# EAGLE design Yahtzee (EAGLE 9.6.2)
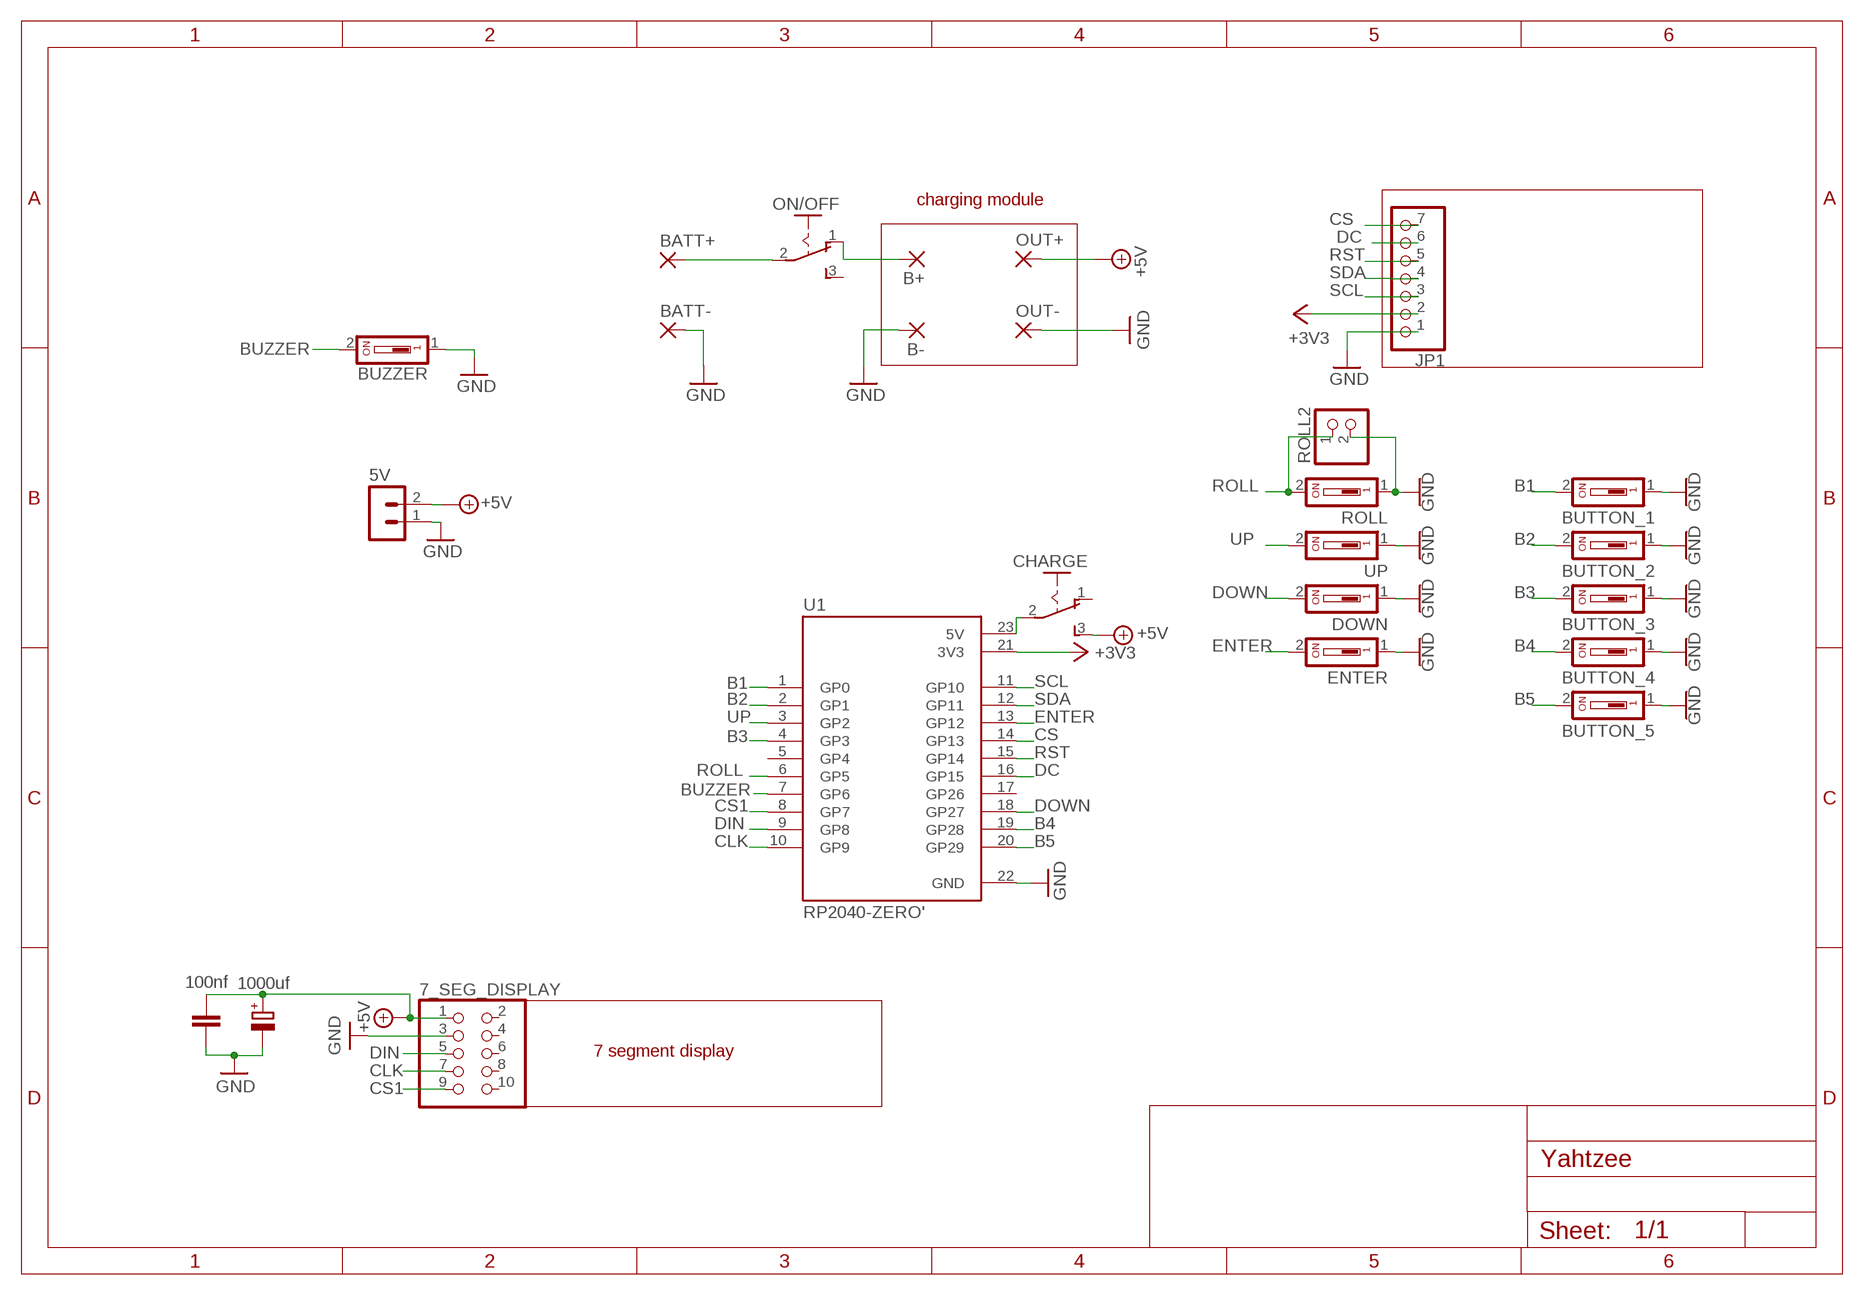
[diagram p0: schematic, sheet 1]

## Parts
5V  B2B-PH-K-S  [B2B-PH-K-S]
7_SEG_DISPLAY  PINHD-2X5  [2X05]
B+  SMD5  [SMD2,54-5,08]
B-  SMD5  [SMD2,54-5,08]
BATT+  SMD5  [SMD2,54-5,08]
BATT-  SMD5  [SMD2,54-5,08]
BUTTON_1  DS01  [DS-01]
BUTTON_2  DS01  [DS-01]
BUTTON_3  DS01  [DS-01]
BUTTON_4  DS01  [DS-01]
BUTTON_5  DS01  [DS-01]
BUZZER  DS01  [DS-01]
C1  100nf  C-EU050-024X044  [C050-024X044]
C2  1000uf  CPOL-EUE2.5-7  [E2,5-7]
CHARGE  M251  [M251]
DOWN  DS01  [DS-01]
ENTER  DS01  [DS-01]
JP1  PINHD-1X7  [1X07]
ON/OFF  M251  [M251]
OUT+  SMD5  [SMD2,54-5,08]
OUT-  SMD5  [SMD2,54-5,08]
ROLL  DS01  [DS-01]
ROLL2  PINHD-1X2  [1X02]
U1  RP2040-ZERO'  [MODULE_RP2040-ZERO]
UP  DS01  [DS-01]

## Nets
+3V3: JP1.2 U1.21(3V3)
+5V: 5V.2 7_SEG_DISPLAY.1 C1.1 C2.+ CHARGE.3(S) OUT+.1(P)
B1: BUTTON_1.2 U1.1(GP0)
B2: BUTTON_2.2 U1.2(GP1)
B3: BUTTON_3.2 U1.4(GP3)
B4: BUTTON_4.2 U1.19(GP28)
B5: BUTTON_5.2 U1.20(GP29)
BUZZER: BUZZER.2 U1.7(GP6)
CLK: 7_SEG_DISPLAY.7 U1.10(GP9)
CS: JP1.7 U1.14(GP13)
CS1: 7_SEG_DISPLAY.9 U1.8(GP7)
DC: JP1.6 U1.16(GP15)
DIN: 7_SEG_DISPLAY.5 U1.9(GP8)
DOWN: DOWN.2 U1.18(GP27)
ENTER: ENTER.2 U1.13(GP12)
GND: 5V.1 7_SEG_DISPLAY.3 B-.1(P) BATT-.1(P) BUTTON_1.1 BUTTON_2.1 BUTTON_3.1 BUTTON_4.1 BUTTON_5.1 BUZZER.1 C1.2 C2.- DOWN.1 ENTER.1 JP1.1 OUT-.1(P) ROLL2.2 ROLL.1 U1.22(GND) UP.1
N$1: BATT+.1(P) ON/OFF.2(P)
N$2: B+.1(P) ON/OFF.1(O)
N$3: CHARGE.2(P) U1.23(5V)
ROLL: ROLL2.1 ROLL.2 U1.6(GP5)
RST: JP1.5 U1.15(GP14)
SCL: JP1.3 U1.11(GP10)
SDA: JP1.4 U1.12(GP11)
UP: U1.3(GP2) UP.2
Unconnected: 7_SEG_DISPLAY.2 7_SEG_DISPLAY.4 7_SEG_DISPLAY.6 7_SEG_DISPLAY.8 7_SEG_DISPLAY.10 CHARGE.1(O) ON/OFF.3(S) U1.5(GP4) U1.17(GP26)

## Notes on the sheet
- charging module
- 7 segment display

## Library data of the parts
5V = con-JST PH:B2B-PH: JST PH series header 2.00mm pitch disconnectable crimp style connectors, vertical (side entry type), 2 pins
7_SEG_DISPLAY = pinhead:PINHD-2X5: PIN HEADER
B+ B- BATT+ BATT- OUT+ OUT- = wirepad:SMD5: SMD PAD
BUTTON_1-BUTTON_5 DOWN ENTER ROLL UP = 5mm SPST Switch:DS01: DIL/CODE SWITCH; OC_FARNELL: unknown; OC_NEWARK: unknown
BUZZER = buzzer:DS01: DIL/CODE SWITCH; OC_FARNELL: unknown; OC_NEWARK: unknown
C1 = rcl:C-EU: CAPACITOR, European symbol; SPICEPREFIX: C
C2 = rcl:CPOL-EU: POLARIZED CAPACITOR, European symbol; SPICEPREFIX: C
CHARGE ON/OFF = switches M Dunn:M251: SLIDING SWITCH Mors, distributor Buerklin, 11G702
JP1 = pinhead:PINHD-1X7: PIN HEADER
ROLL2 = pinhead:PINHD-1X2: PIN HEADER
U1 = RP2040-ZERO:RP2040-ZERO: Check availability <https://pricing.snapeda.com/parts/RP2040-ZERO/Waveshare%20Electronics/view-part?ref=eda>; AVAILABILITY: Not in stock; CHECK_PRICES: https://www.snapeda.com/parts/RP2040-ZERO/Waveshare+Electronics/view-part/?ref=eda; DESCRIPTION: Low-Cost, High-Performance Pico-Like MCU Board Based On Raspberry Pi Microcontroller RP2040; MF: Waveshare Electronics; MP: RP2040-ZERO; PACKAGE: Package; PRICE: None; SNAPEDA_LINK: https://www.snapeda.com/parts/RP2040-ZERO/Waveshare+Electronics/view-part/?ref=snap

## Board
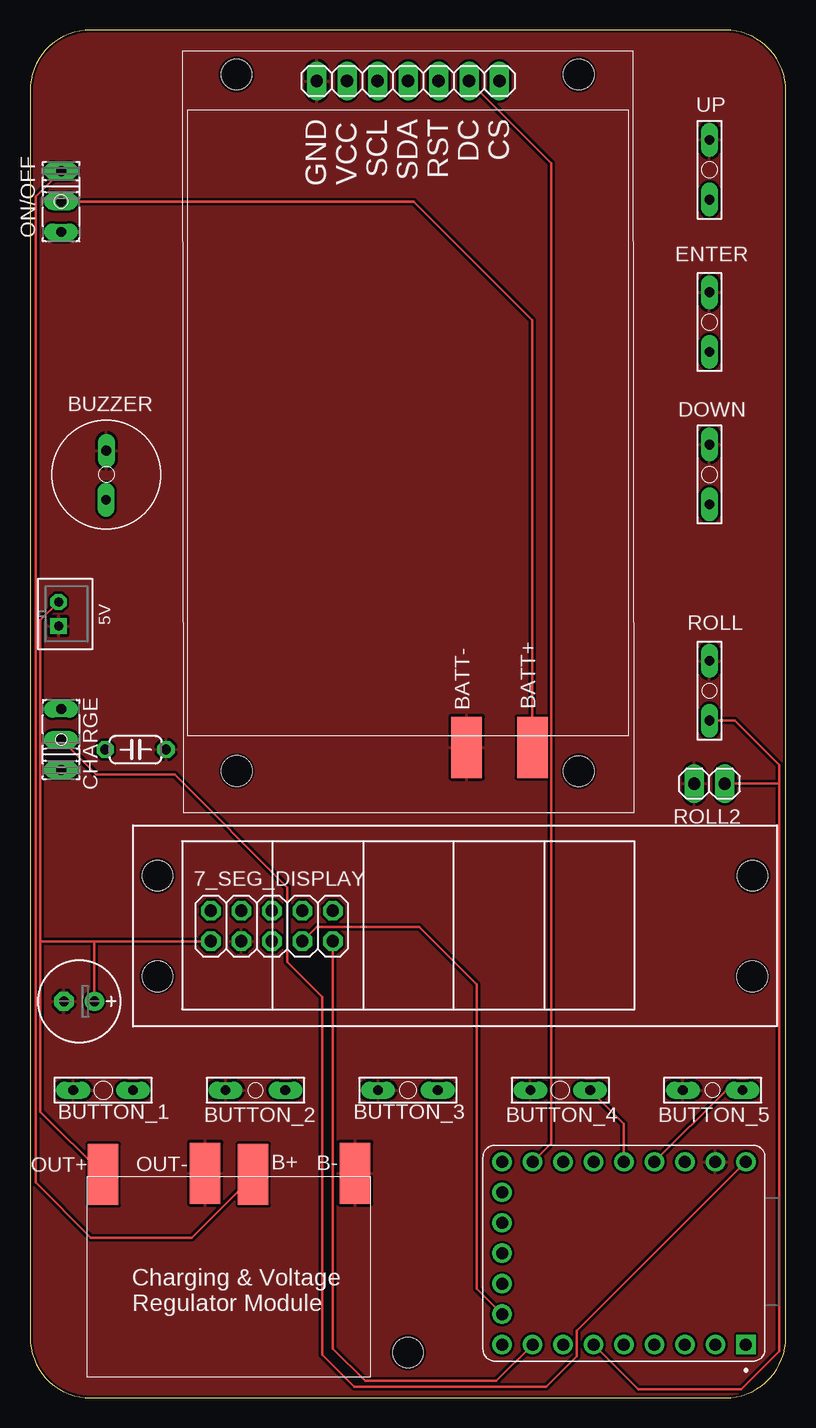
[diagram p1: board, top side]
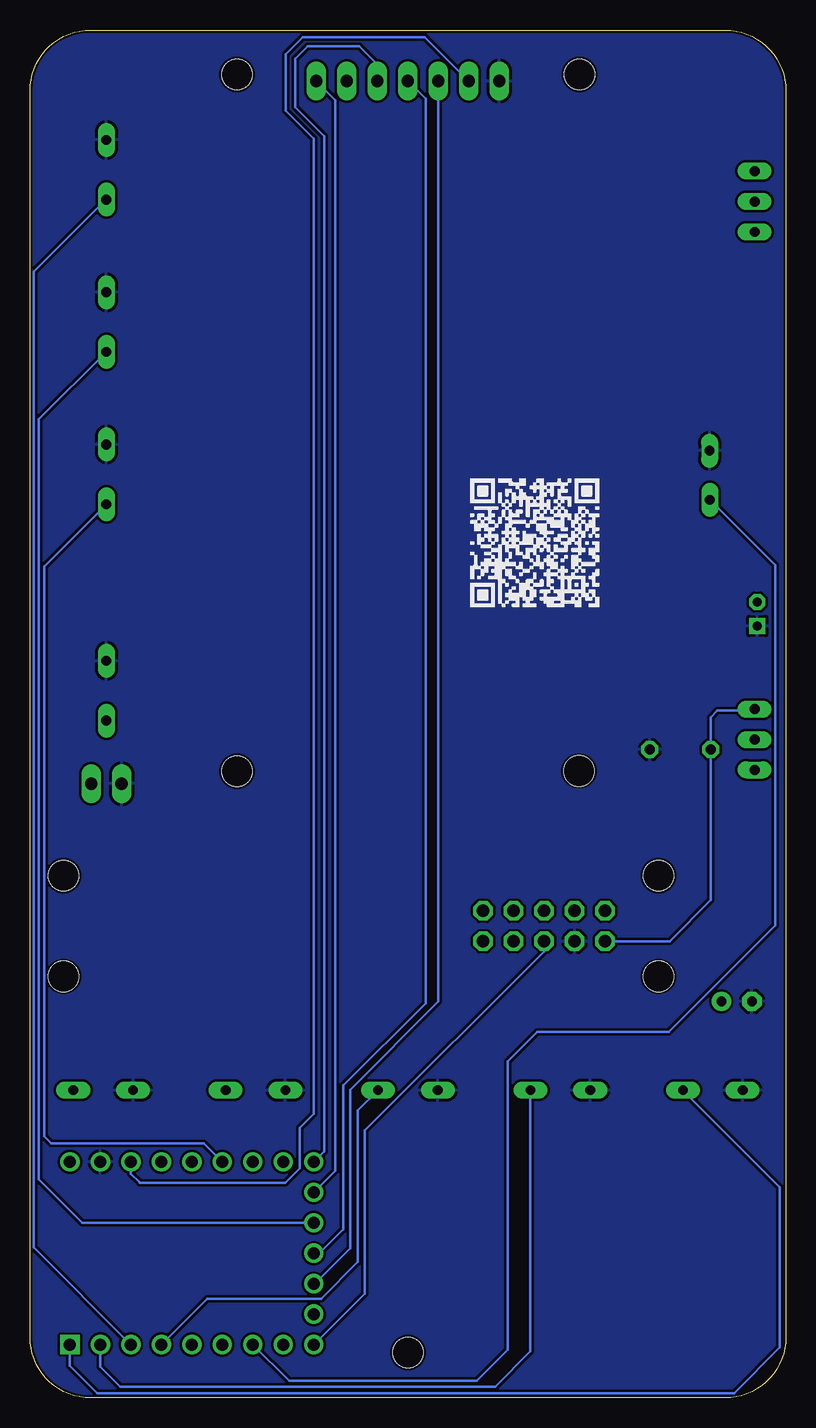
[diagram p2: board, bottom side, seen from below]

Size 62.99 x 114.04 mm. Coordinates in mm from the lower left corner, seen from the top.
Outline: 57.91,114.04 5.08,114.04 arc90 0,108.96 0,5.08 arc90 5.08,0 57.91,0 arc90 62.99,5.08 62.99,108.96 arc90 57.91,114.04
Copper layers (1*16): Top 0.035mm / dielectric 1.5mm / Bottom 0.035mm
Design rules "SparkFun": minimum track width 8mil, minimum drill 20mil, track to track 8mil, track to pad 8mil, pad to pad 8mil, via to via 8mil, smd to smd 8mil, copper to edge 8mil, drill to drill 8mil, minimum pad ring 12mil, minimum via ring 10mil, stop-mask expansion 4mil, vias tented up to drill 20mil, thermal gap 10mil
Holes 2.54 mm at 45.73,110.34 45.73,52.24 17.23,52.26 17.2,110.34 10.62,43.55 10.61,35.14 60.21,43.55 60.19,35.14 31.49,3.8

### Footprints (pad centres in the part's own frame; a part is rotated, then mirrored left to right if it is on the bottom)
B2B-PH-K-S = drill 0.75 pad 1.3 square: 1 1,0 | drill 0.75 pad 1.3 octagon: 2 -1,0
2X05 = drill 1.016 octagon: 1 -5.08,-1.27; 2 -5.08,1.27; 3 -2.54,-1.27; 4 -2.54,1.27; 5 0,-1.27; 6 0,1.27; 7 2.54,-1.27; 8 2.54,1.27; 9 5.08,-1.27; 10 5.08,1.27
SMD2,54-5,08 = smd 2.54 x 5.08: 1 0,0
DS-01 = drill 0.813 long: 1 2.489,0; 2 -2.489,0
DS-01' = drill 0.813 long: 1 0,-1.981; 2 0.025,2.108
C050-024X044 = drill 0.813 octagon: 1 -2.54,0; 2 2.54,0
E2,5-7 = drill 0.813 pad 1.6: + -1.27,0 | drill 0.813 pad 1.6 octagon: - 1.27,0
M251 = drill 0.813 long: 1 -2.54,0; 2 0,0; 3 2.54,0
1X07 = drill 1.016 long: 1 -7.62,0; 2 -5.08,0; 3 -2.54,0; 4 0,0; 5 2.54,0; 6 5.08,0; 7 7.62,0
1X02 = drill 1.016 long: 1 -1.27,0; 2 1.27,0
MODULE_RP2040-ZERO = drill 1 square: 1 7.62,10.16 | drill 1: 2 7.62,7.62; 3 7.62,5.08; 4 7.62,2.54; 5 7.62,0; 6 7.62,-2.54; 7 7.62,-5.08; 8 7.62,-7.62; 9 7.62,-10.16; 10 5.08,-10.16; 11 2.54,-10.16; 12 0,-10.16; 13 -2.54,-10.16; 14 -5.08,-10.16; 15 -7.62,-10.16; 16 -7.62,-7.62; 17 -7.62,-5.08; 18 -7.62,-2.54; 19 -7.62,0; 20 -7.62,2.54; 21 -7.62,5.08; 22 -7.62,7.62; 23 -7.62,10.16

### Placement (x,y rotation side)
5V  2.38,65.35 270 top
7_SEG_DISPLAY  20.15,39.34 0 top
B+  18.59,18.63 180 top
B-  27.1,18.73 180 top
BATT+  41.87,54.23 0 top
BATT-  36.38,54.23 0 top
BUTTON_1  6.09,25.65 180 top
BUTTON_2  18.79,25.65 180 top
BUTTON_3  31.49,25.65 180 top
BUTTON_4  44.19,25.65 180 top
BUTTON_5  56.89,25.65 180 top
BUZZER  [DS-01']  6.36,76.99 180 top
C1  8.8,54.05 0 top
C2  4.1,33.06 180 top
CHARGE  2.6,54.89 90 top
DOWN  56.62,76.99 90 top
ENTER  56.62,89.69 90 top
JP1  31.5,109.78 0 top
ON/OFF  2.6,99.73 270 top
OUT+  6.09,18.63 0 top
OUT-  14.6,18.73 180 top
ROLL  56.62,58.95 90 top
ROLL2  56.62,51.21 180 top
U1  49.5,12.07 270 top
UP  56.62,102.39 90 top

### Tracks (layer width: path | path; a pad name or v marks a point on that pad's centre or on a via)
+3V3
  Bottom 0.203: JP1.2 30.08,113.44 40.24,113.44 41.66,112.01 41.66,107.3 39.36,104.99 39.36,23.67 40.5,22.53 40.5,19.15 41.71,17.93 53.83,17.93 53.89,18 54.59,18.69 54.59,19.67 U1.21
+5V
  Top 0.203: OUT+.1 0.87,23.85 0.87,38.07 | 5V.2 0.87,64.84 0.87,38.07 | 0.87,38.07 5.37,38.07 | 5.37,38.07 7_SEG_DISPLAY.1 | C2.+ 5.37,38.07
  Bottom 0.203: 7_SEG_DISPLAY.1 9.69,38.07 6.26,41.5 C1.1 6.26,56.74 5.7,57.3 2.73,57.3 CHARGE.3
B1
  Bottom 0.203: BUTTON_1.2 0.49,17.56 0.49,4.22 4.3,0.41 57.4,0.41 59.66,2.67 U1.1
B2
  Bottom 0.203: BUTTON_2.2 21.28,3.87 24.21,0.94 55.48,0.94 57.12,2.58 U1.2
B3
  Bottom 0.203: BUTTON_3.2 35.66,23.98 35.66,11.34 38.72,8.28 48.2,8.28 U1.4
B4
  Top 0.203: U1.19 49.5,22.83 BUTTON_4.2
B5
  Top 0.203: U1.20 58.01,25.65 BUTTON_5.2
BUZZER
  Bottom 0.203: U1.7 41.4,1.42 25.76,1.42 23.16,4.03 23.16,28.05 20.71,30.51 9.77,30.51 0.87,39.41 0.87,69.42 BUZZER.2
CLK
  Top 0.203: U1.10 37.22,9.11 37.22,34.47 32.42,39.27 23.88,39.27 7_SEG_DISPLAY.7
CS
  Bottom 0.203: U1.14 37.54,18.95 37.54,108.19 JP1.7
CS1
  Top 0.203: U1.8 38.86,1.42 27.92,1.42 25.23,4.11 7_SEG_DISPLAY.9
DC
  Top 0.203: U1.16 43.43,21.23 43.43,26.15 43.44,26.13 43.44,102.92 JP1.6
DIN
  Bottom 0.203: U1.9 35.09,8.7 35.09,22.3 20.15,37.24 7_SEG_DISPLAY.5
DOWN
  Bottom 0.203: U1.18 48.51,21.23 61.2,21.23 61.78,21.82 61.78,69.32 56.62,74.47 DOWN.2
ENTER
  Bottom 0.203: ENTER.2 62.24,81.58 62.24,18.21 58.63,14.61 U1.13
GND
  pour Top: 0.03,114.12 62.99,114.12 62.99,0.03 0.03,0.03
  pour Bottom: 0.03,114.12 62.99,114.12 62.99,0.03 0.03,0.03
N$1
  Top 0.203: BATT+.1 41.87,89.85 31.99,99.73 ON/OFF.2
N$2
  Top 0.203: B+.1 18.59,18.48 13.47,13.36 5.06,13.36 0.47,17.96 0.47,100.14 ON/OFF.1
N$3
  Top 0.203: U1.23 45.58,5.6 45.58,3.45 43.04,0.91 27.03,0.91 24.37,3.58 24.37,33.43 21.45,36.35 21.45,42.57 12.05,51.97 5.52,51.97 CHARGE.2
ROLL
  Top 0.203: U1.6 50.69,0.72 59.26,0.72 62.44,3.89 62.44,51.18 | 62.44,51.18 62.44,52.76 58.73,56.46 ROLL.2 | ROLL2.1 62.42,51.21 62.44,51.18
RST
  Bottom 0.203: U1.15 38.46,20.56 38.46,105.18 40.88,107.59 40.88,111.66 39.86,112.67 35.54,112.67 34.04,111.18 JP1.5
SCL
  Bottom 0.203: U1.11 39.25,9.53 36.3,12.47 36.3,25.7 28.95,33.05 28.95,109.77 JP1.3
SDA
  Bottom 0.203: U1.12 38.87,12.07 36.88,14.06 36.88,26.05 30.02,32.91 30.02,108.29 JP1.4
UP
  Bottom 0.203: U1.3 62.68,12.55 62.68,93.9 56.69,99.9 UP.2

### Text on the board
tPlace: GND | VCC | SCL | SDA | RST | DC | CS | Charging & Voltage / Regulator Module